# Altium schematic sheet Batt_Charger.SchDoc: Cargador de Batería y Regulador
size A4; CompanyName: Introducción al Diseño de Circuitos Impresos; Organization: UTN FRBA; DocumentNumber: 4; Revision: 01; SheetNumber: 4; SheetTotal: 9; Autor: Eugenia Ipar
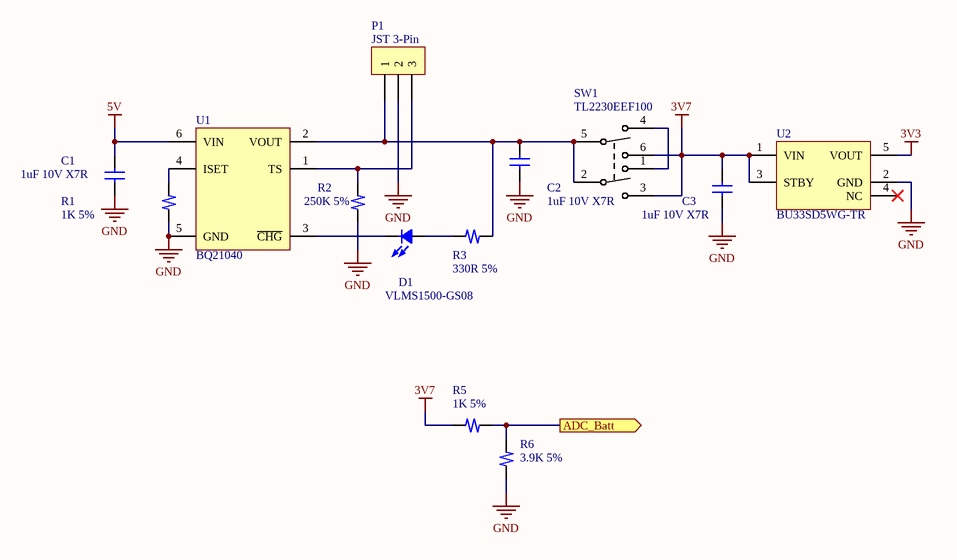
[diagram p0: Batt_Charger.SchDoc]

## Parts
C1  1uF 10V X7R  [C_0402]
C2  1uF 10V X7R  [C_0402]
C3  1uF 10V X7R  [C_0402]
D1  VLMS1500-GS08  [L_0402]
P1  JST 3-Pin  [BATT CONNECTOR]
R1  1K 5%  [R_0402]
R2  250K 5%  [R_0402]
R3  330R 5%  [R_0402]
R5  1K 5%  [R_0402]
R6  3.9K 5%  [R_0402]
SW1  TL2230EEF100  [TL2230]
U1  BQ21040  [SOT-23 (6)]
U2  BU33SD5WG-TR  [SSOP5]

## Ports
ADC_Batt (out)

## Nets
3V3: U2.5(VOUT)
3V7: C3.1 R5.1 SW1.3 SW1.6 U2.1(VIN) U2.3(STBY)
5V: C1.1 U1.6(VIN)
GND: C1.2 C2.2 C3.2 P1.2 R1.1 R2.1 R6.1 U1.5(GND) U2.2(GND)
ADC_Batt: R5.2 R6.2 ; port ADC_Batt
NetC2_1: C2.1 P1.1 R3.1 SW1.2 SW1.5 U1.2(VOUT)
NetD1_1: D1.1 R3.2
NetD1_2: D1.2 U1.3(~{CHG})
NetP1_3: P1.3 R2.2 U1.1(TS)
NetR1_2: R1.2 U1.4(ISET)
NetSW1_1: SW1.1 SW1.4

Not connected (* = marked no-connect by the designer): U2 4(NC)*

## Notes on the sheet
- Title:
- Size:
- Author:
- A4
- Sheet
- of
- Revision:
- File:
- Date:

## Library data of the parts
C1-C3 = Ceramic Capacitor: Ceramic Capacitor SMD 0402
D1 = Diode LED: LED Diode SMD 0402
P1 = 3-Pin Header: JST Right Angle Connector THD 3-Pin PN: PRT-09750
R1-R3 R5 R6 = Resistor: Resistor SMD 0402
SW1 = PushButton Switch: PushButton Switch Latching THD TL2230EEF100
U1 = BQ21040 Charger: BQ21040 0.8A Sigle Cell Li-Ion Battery Charger SOT-23
U2 = LDO CMOS Regulator: LDO Voltage Regulator 1ch 500mA CMOS SSOP5